# EasyEDA schematic 1-Schematic_bmi160-tester.json
TITLE: Sheet_1; REV: 1.0; Date: 2023-01-09; Sheet: 1/1; Drawn By: crying_cat; Company: Your Company
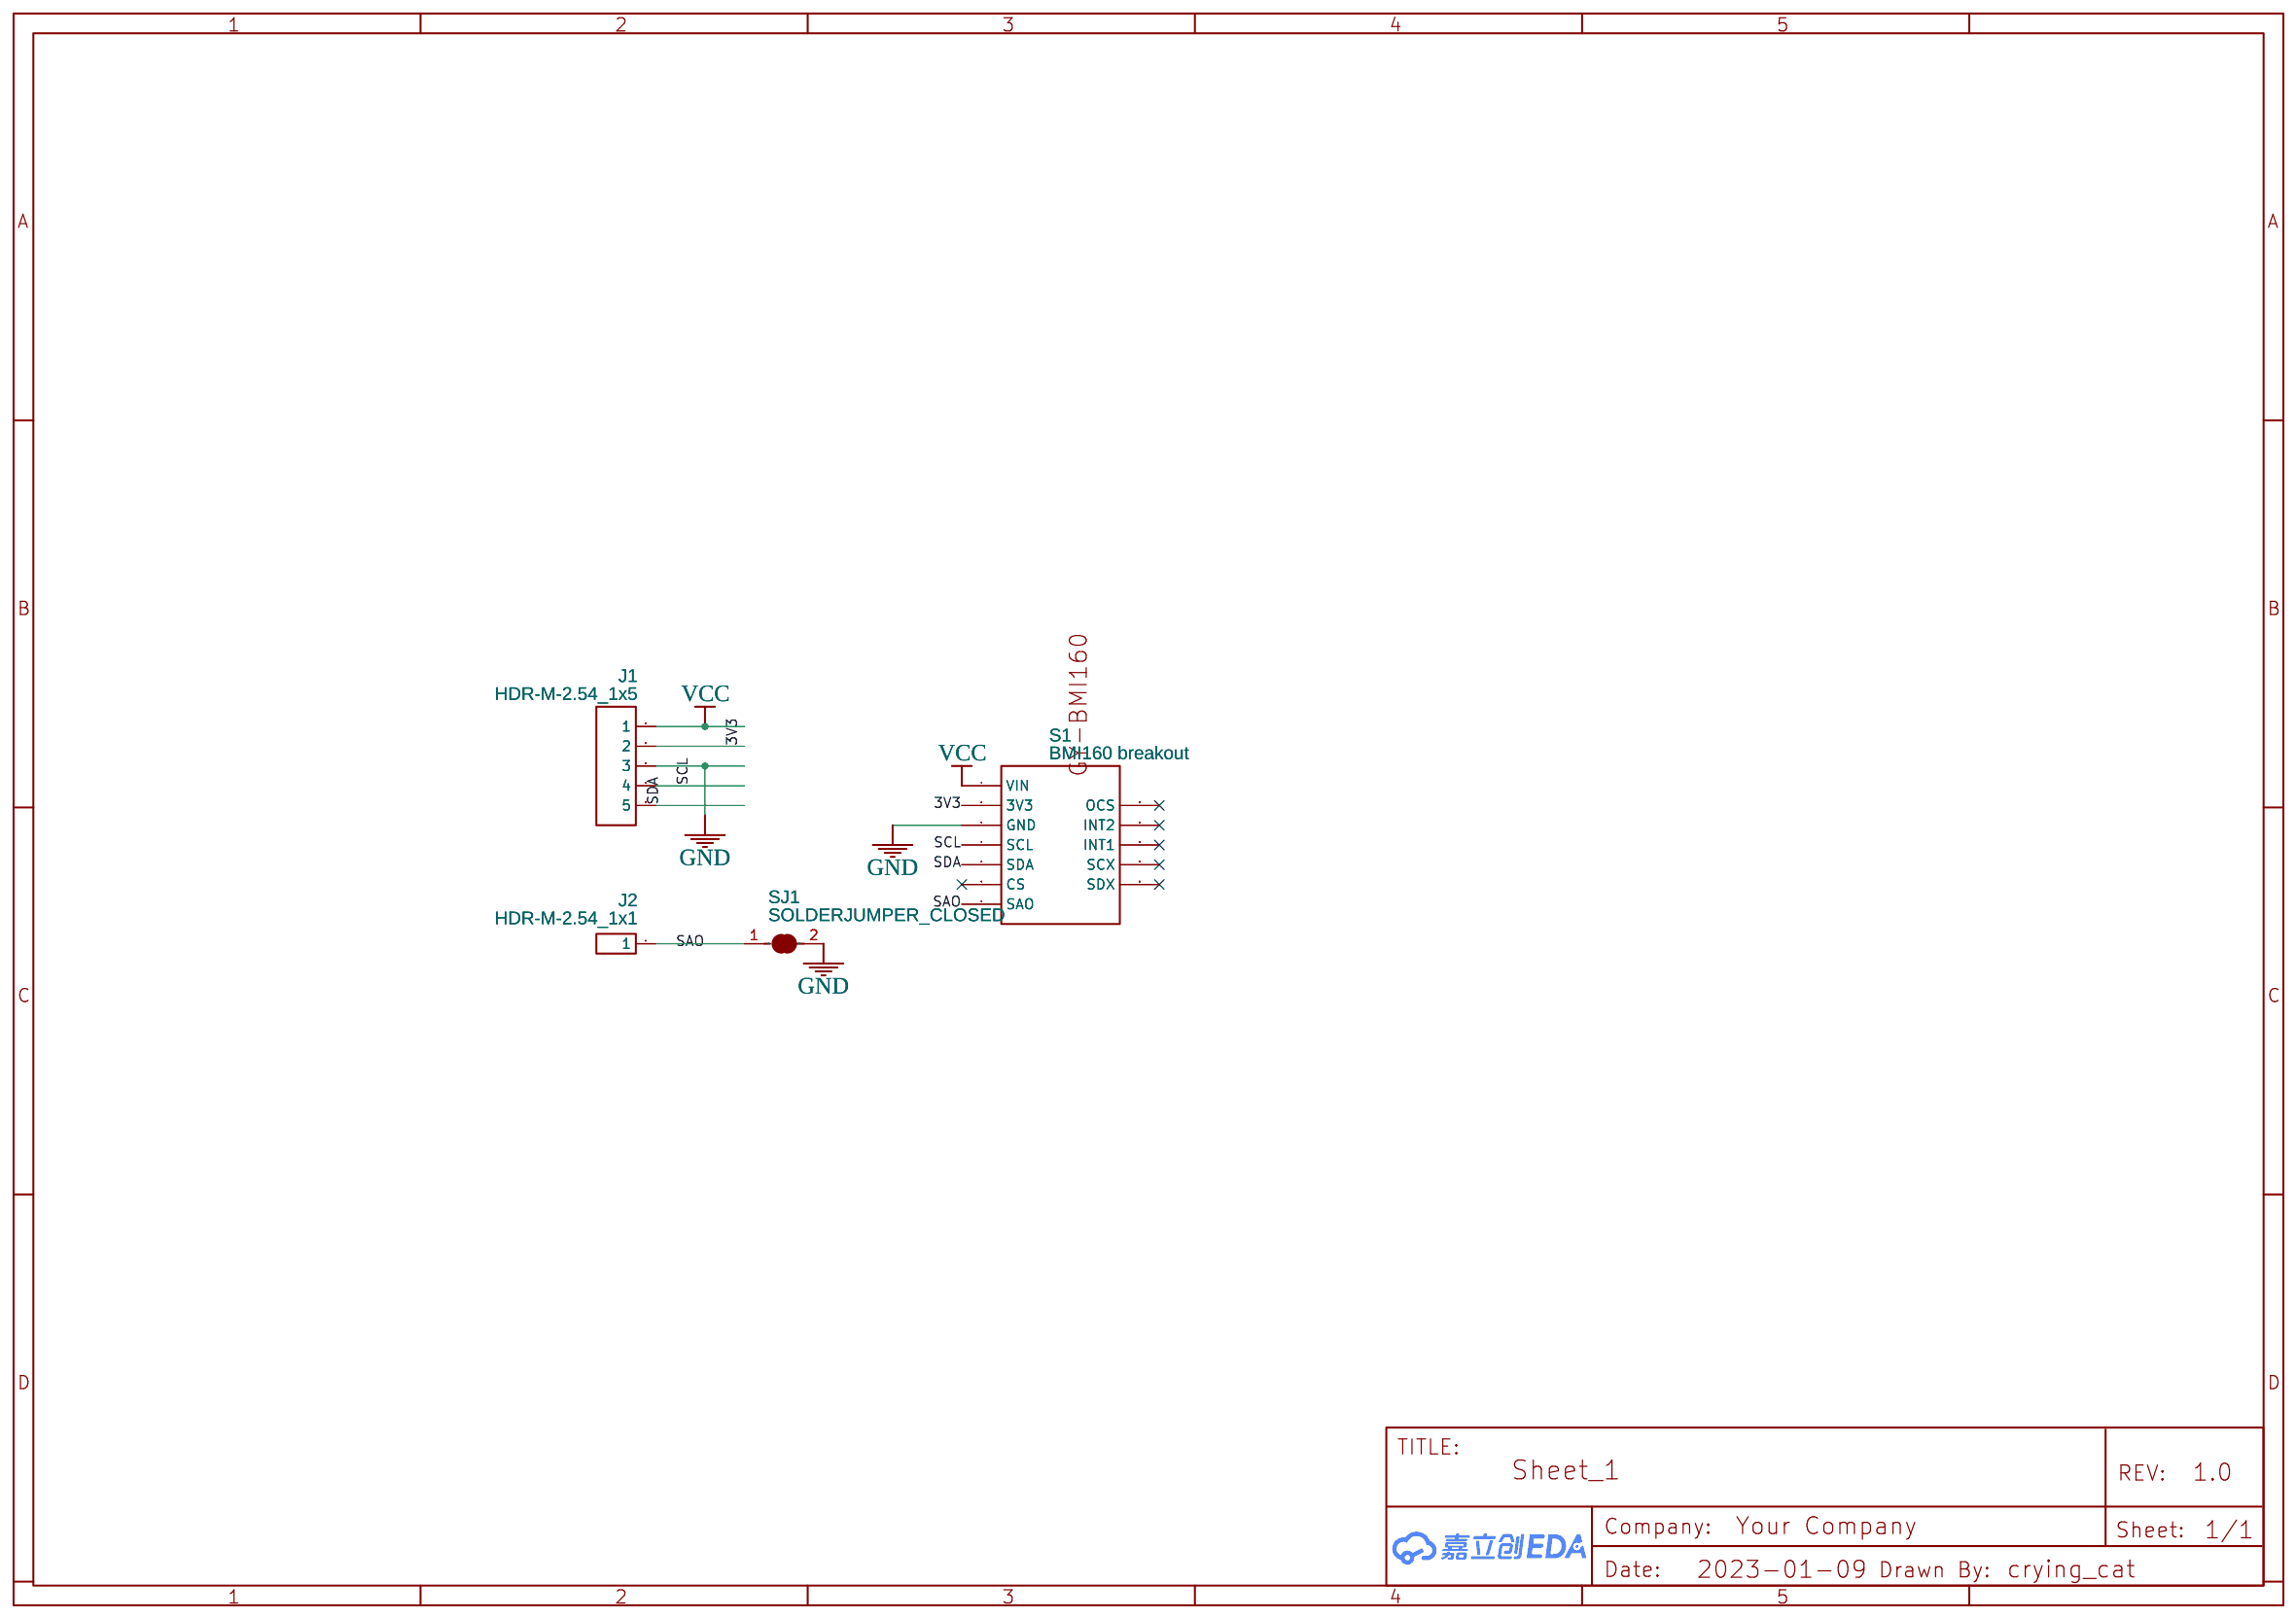
[diagram p0: schematic sheet]

## Parts
J1  HDR-M-2.54_1x5  [HDR-M-2.54_1X5]
J2  HDR-M-2.54_1x1  [HDR-M-2.54_1X1]
S1  BMI160 breakout  [BMI160-BREAKOUT]
SJ1  SOLDERJUMPER_CLOSED  [SOLDERJUMPER_CLOSEDWIRE]

## Library data of the parts
J1 = HDR-M-2.54_1x5: Supplier Part: C358687; Supplier: LCSC; Contributor: LCEDA_Lib
J2 = HDR-M-2.54_1x1: Supplier Part: C81276; Supplier: LCSC; Contributor: LCEDA_Lib
S1 = BMI160 breakout: Contributor: crying_cat
SJ1 = SOLDERJUMPER_CLOSED: Contributor: other account

## Nets
3V3: J1.2 S1.6(3V3)
GND: J1.3 S1.5(GND) SJ1.2
VCC: J1.1 S1.7(VIN)
SAO: J2.1 S1.1(SAO) SJ1.1
SCL: J1.4 S1.4(SCL)
SDA: J1.5 S1.3(SDA)

Not connected (* = marked no-connect by the designer): S1 2(CS)* 8(OCS)* 9(INT2)* 10(INT1)* 11(SCX)* 12(SDX)*
